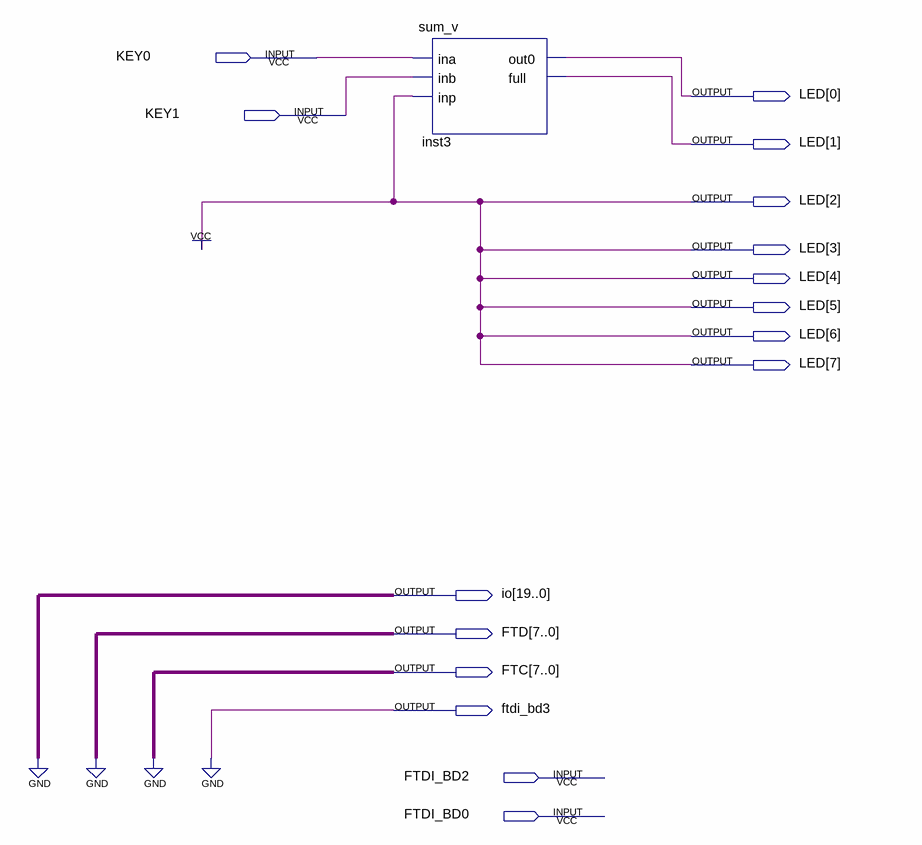
[diagram p0: schematic sheet]
// Quartus schematic max10.bdf as structural Verilog: 1 symbols, 16 pins
module max10 (
  input  KEY0,
  input  KEY1,
  input  FTDI_BD2,
  input  FTDI_BD0,
  output [7:0] LED,
  output [19:0] io,
  output [7:0] FTD,
  output [7:0] FTC,
  output ftdi_bd3
);

  sum_v inst3 (.ina(KEY0), .inb(KEY1), .inp(1'b1), .out0(LED[0]), .full(LED[1]));

  assign FTC = {8{1'b0}};
  assign FTD = {8{1'b0}};
  assign ftdi_bd3 = 1'b0;
  assign io = {20{1'b0}};
  assign LED[7:2] = {6{1'b1}};
endmodule
